# EAGLE design usbprog_small (EAGLE 4.16)
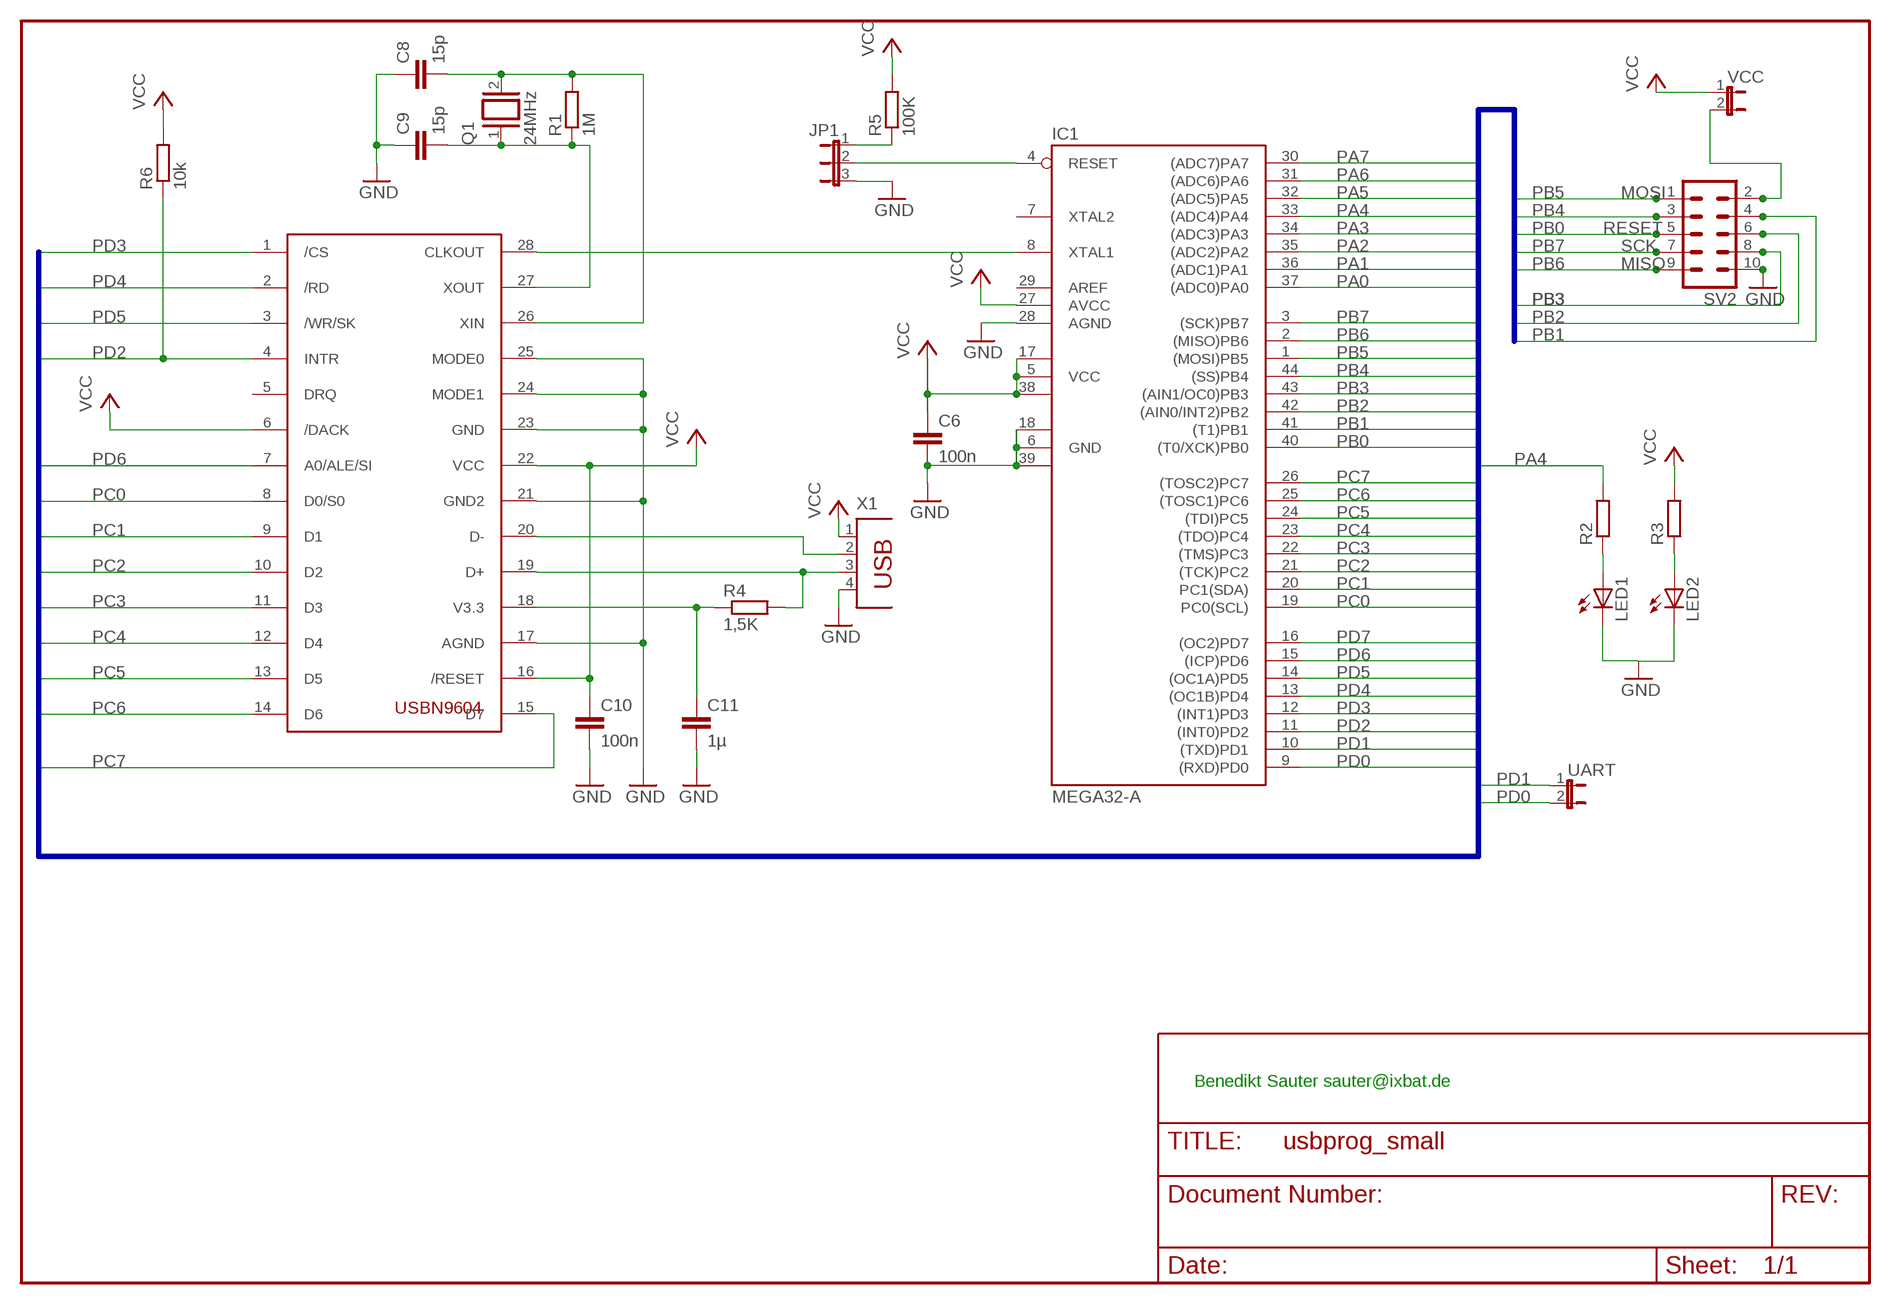
[diagram p0: schematic, sheet 1]

## Parts
C6  100n  C-EUC1206  [C1206]
C8  15p  C-EUC1206  [C1206]
C9  15p  C-EUC1206  [C1206]
C10  100n  C-EUC1206  [C1206]
C11  1µ  C-EUC1206  [C1206]
IC1  MEGA32-A  [TQFP44]
JP1  JP2E  [JP2]
LED1  LEDCHIP-LED0805  [CHIP-LED0805]
LED2  LEDCHIP-LED0805  [CHIP-LED0805]
M1  USBN9604  [SO28-3]
Q1  24MHz  XTAL/S  [QS]
R1  1M  R-EU_R1206  [R1206]
R2  R-EU_M1206  [M1206]
R3  R-EU_M1206  [M1206]
R4  1,5K  R-EU_M1206  [M1206]
R5  100K  R-EU_R1206  [R1206]
R6  10k  R-EU_R1206  [R1206]
SV2  ML10L  [ML10L]
UART  JP1E  [JP1]
VCC  JP1E  [JP1]
X1  PN61729  [PN61729]

## Nets
GND: C6.2 C8.1 C9.1 C10.2 C11.2 IC1.6(GND) IC1.18(GND1) IC1.28(AGND) IC1.39(GND2) JP1.3 LED1.C LED2.C M1.17(AGND) M1.21(GND2) M1.23(GND) M1.24(MODE1) M1.25(MODE0) SV2.10 X1.4
N$3: UART.1
N$4: IC1.8(XTAL1) M1.28(CLKOUT)
N$5: JP1.1 R5.1
N$7: C11.1 M1.18(V3.3) R4.1
N$8: C8.2 M1.26(XIN) Q1.2 R1.2
N$9: LED1.A R2.1
N$10: LED2.A R3.1
N$11: C9.2 M1.27(XOUT) Q1.1 R1.1
N$12: M1.19(D+) R4.2 X1.3
N$13: UART.2
N$14: SV2.2 VCC.2
N$15: M1.20(D-) X1.2
PA0: IC1.37((ADC0)PA0)
PA1: IC1.36((ADC1)PA1)
PA2: IC1.35((ADC2)PA2)
PA3: IC1.34((ADC3)PA3)
PA4: IC1.33((ADC4)PA4) R2.2
PA5: IC1.32((ADC5)PA5)
PA6: IC1.31((ADC6)PA6)
PA7: IC1.30((ADC7)PA7)
PB0: IC1.40((T0/XCK)PB0) SV2.5
PB1: IC1.41((T1)PB1) SV2.4
PB2: IC1.42((AIN0/INT2)PB2) SV2.6
PB3: IC1.43((AIN1/OC0)PB3) SV2.8
PB4: IC1.44((SS)PB4) SV2.3
PB5: IC1.1((MOSI)PB5) SV2.1
PB6: IC1.2((MISO)PB6) SV2.9
PB7: IC1.3((SCK)PB7) SV2.7
PC0: IC1.19(PC0(SCL)) M1.8(D0/S0)
PC1: IC1.20(PC1(SDA)) M1.9(D1)
PC2: IC1.21((TCK)PC2) M1.10(D2)
PC3: IC1.22((TMS)PC3) M1.11(D3)
PC4: IC1.23((TDO)PC4) M1.12(D4)
PC5: IC1.24((TDI)PC5) M1.13(D5)
PC6: IC1.25((TOSC1)PC6) M1.14(D6)
PC7: IC1.26((TOSC2)PC7) M1.15(D7)
PD0: IC1.9((RXD)PD0)
PD1: IC1.10((TXD)PD1)
PD2: IC1.11((INT0)PD2) M1.4(INTR) R6.1
PD3: IC1.12((INT1)PD3) M1.1(/CS)
PD4: IC1.13((OC1B)PD4) M1.2(/RD)
PD5: IC1.14((OC1A)PD5) M1.3(/WR/SK)
PD6: IC1.15((ICP)PD6) M1.7(A0/ALE/SI)
PD7: IC1.16((OC2)PD7)
RESET: IC1.4(RESET) JP1.2
VCC: C6.1 C10.1 IC1.5(VCC) IC1.17(VCC1) IC1.27(AVCC) IC1.38(VCC2) M1.6(/DACK) M1.16(/RESET) M1.22(VCC) R3.2 R5.2 R6.2 VCC.1 X1.1
Unconnected: IC1.7(XTAL2) M1.5(DRQ)

## Buses
PD0,PD1,PD2,PD3,PD4,PD5,PD6,PD7,PC0,PC1,PC2,PC3,PC4,PC5,PC6,PC7,PB0,PB1,PB2,PB3,PB4,PB5,PB6,PB7,PA0,PA1,PA2,PA3,PA4,PA5,PA6,PA7

## Notes on the sheet
- MOSI
- PB4
- RESET
- SCK
- MISO
- PB3 | PB3
- PB2
- PB1
- Benedikt Sauter sauter@ixbat.de

## Power pins joined to a net without a drawn wire
AREF: IC1.29(AREF)

## Library data of the parts
C6 C8-C11 = rcl:C-EU: CAPACITOR, European symbol
IC1 = avr:MEGA32: MICROCONTROLLER 32 Kbytes FLASH 2 Kbytes SRAM 1 Kbytes EEPROM USART 8-channel 10 bit ADC
JP1 = jumper:JP2E: JUMPER
LED1 LED2 = led:LED: LED OSRAM: - CHIPLED LG R971, LG N971, LY N971, LG Q971, LY Q971, LO R971, LY R971 LH N974, LH R974 LS Q976, LO Q976, LY Q976 LO Q996 - Hyper CHIPLED LW Q18S LB Q993, LB Q99A, LB R99A - SideLED LS A670, LO A670, LY A670, LG A670, LP A670 LB A673, LV A673, LT A673, LW A673 LH A674 LY A675 LS A676, LA A676, LO A676, LY A676, LW A676 LS A679, LY A679, LG A679 - Hyper Micro SIDELED® LS Y876, LA Y876, LO Y876, LY Y876 LT Y87S - SmartLED LW L88C, LW L88S LB L89C, LB L89S, LG L890 LS L89K, LO L89K, LY L89K LS L896, LA L896, LO L896, LY L896 - TOPLED LS T670, LO T670, LY T670, LG T670, LP T670 LSG T670, LSP T670, LSY T670, LOP T670, LYG T670 LG T671, LOG T671, LSG T671 LB T673, LV T673, LT T673, LW T673 LH T674 LS T676, LA T676, LO T676, LY T676, LB T676, LH T676, LSB T676, LW T676 LB T67C, LV T67C, LT T67C, LS T67K, LO T67K, LY T67K, LW E67C LS E67B, LA E67B, LO E67B, LY E67B, LB E67C, LV E67C, LT E67C LW T67C LS T679, LY T679, LG T679 LS T770, LO T770, LY T770, LG T770, LP T770 LB T773, LV T773, LT T773, LW T773 LH T774 LS E675, LA E675, LY E675, LS T675 LS T776, LA T776, LO T776, LY T776, LB T776 LHGB T686 LT T68C, LB T68C - Hyper Mini TOPLED® LB M676 - Mini TOPLED Santana® LG M470 LS M47K, LO M47K, LY M47K Source: http://www.osram.convergy.de/
M1 = bene:USBN9604
Q1 = special:XTAL/S: CRYSTAL
R1-R6 = rcl:R-EU_: RESISTOR, European symbol
SV2 = con-harting-ml:ML10: HARTING
UART VCC = jumper:JP1E: JUMPER
X1 = con-berg:PN61729: BERG USB connector

## Board
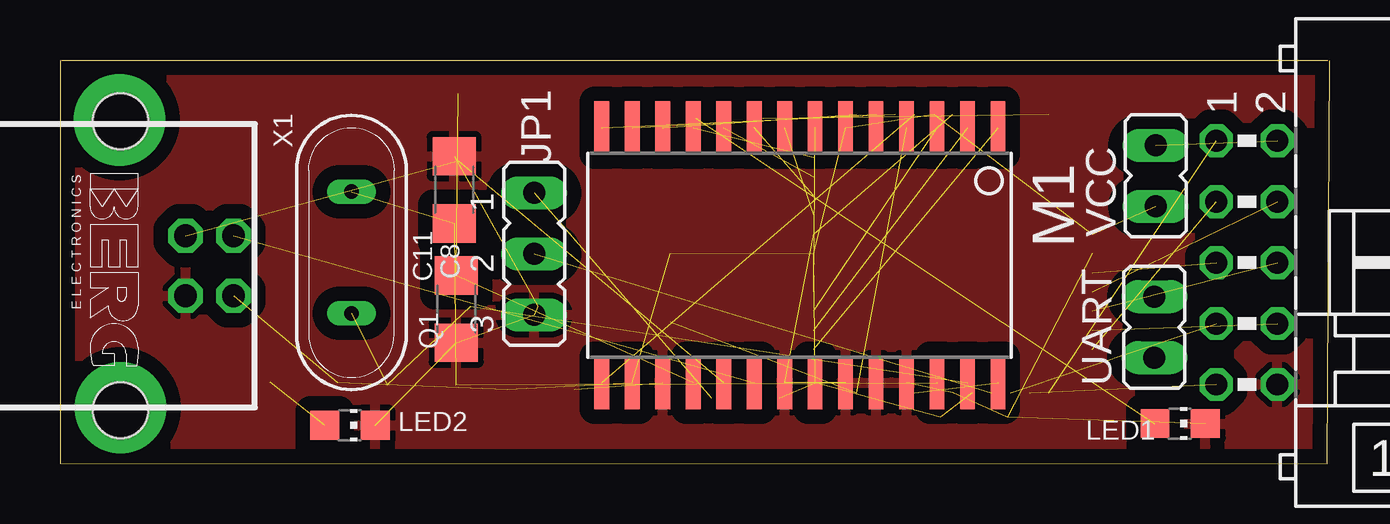
[diagram p1: board, top side]
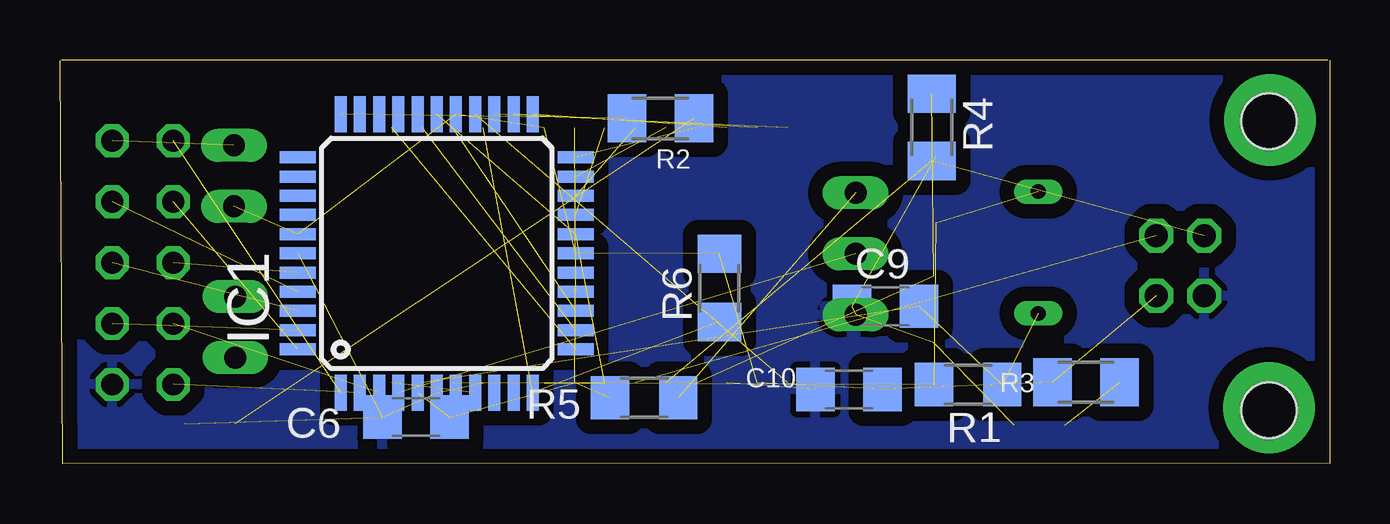
[diagram p2: board, bottom side, seen from below]

Size 52.9 x 16.81 mm. Coordinates in mm from the lower left corner, seen from the top.
Outline: 52.9,16.78 52.8,0 0,0.01 0,16.81
Outline: 0.07,16.81 52.82,16.81
Copper layers (1*16): Top 0.035mm / dielectric 1.5mm / Bottom 0.035mm
Design rules "ZWILLING": minimum track width 5mil, minimum drill 20mil, track to track 4mil, track to pad 4mil, pad to pad 4mil, via to via 4mil, smd to smd 0mil, copper to edge 1mil, drill to drill 1mil, minimum pad ring 8mil, minimum via ring 8mil, stop-mask expansion 4mil, vias tented up to drill 0mil, thermal gap 10mil

### Footprints (pad centres in the part's own frame; a part is rotated, then mirrored left to right if it is on the bottom)
C1206 = smd 1.6 x 1.8: 1 -1.4,0; 2 1.4,0
TQFP44 = smd 1.5 x 0.5: 1 -5.8,4; 2 -5.8,3.2; 3 -5.8,2.4; 4 -5.8,1.6; 5 -5.8,0.8; 6 -5.8,0; 7 -5.8,-0.8; 8 -5.8,-1.6; 9 -5.8,-2.4; 10 -5.8,-3.2; 11 -5.8,-4; 23 5.8,-4; 24 5.8,-3.2; 25 5.8,-2.4; 26 5.8,-1.6; 27 5.8,-0.8; 28 5.8,0; 29 5.8,0.8; 30 5.8,1.6; 31 5.8,2.4; 32 5.8,3.2; 33 5.8,4 | smd 0.5 x 1.5: 12 -4,-5.8; 13 -3.2,-5.8; 14 -2.4,-5.8; 15 -1.6,-5.8; 16 -0.8,-5.8; 17 0,-5.8; 18 0.8,-5.8; 19 1.6,-5.8; 20 2.4,-5.8; 21 3.2,-5.8; 22 4,-5.8; 34 4,5.8; 35 3.2,5.8; 36 2.4,5.8; 37 1.6,5.8; 38 0.8,5.8; 39 0,5.8; 40 -0.8,5.8; 41 -1.6,5.8; 42 -2.4,5.8; 43 -3.2,5.8; 44 -4,5.8
JP2 = drill 0.914 long: 1 -2.54,0; 2 0,0; 3 2.54,0
CHIP-LED0805 = smd 1.2 x 1.2: A 0,-1.05; C 0,1.05
SO28-3 = smd 0.61 x 2.21: 1 -8.255,-5.315; 2 -6.985,-5.315; 3 -5.715,-5.315; 4 -4.445,-5.315; 5 -3.175,-5.315; 6 -1.905,-5.315; 7 -0.635,-5.315; 8 0.635,-5.315; 9 1.905,-5.315; 10 3.175,-5.315; 11 4.445,-5.315; 12 5.715,-5.315; 13 6.985,-5.315; 14 8.255,-5.315; 15 8.255,5.315; 16 6.985,5.315; 17 5.715,5.315; 18 4.445,5.315; 19 3.175,5.315; 20 1.905,5.315; 21 0.635,5.315; 22 -0.635,5.315; 23 -1.905,5.315; 24 -3.175,5.315; 25 -4.445,5.315; 26 -5.715,5.315; 27 -6.985,5.315; 28 -8.255,5.315
QS = drill 0.61 long: 1 -2.54,0; 2 2.54,0
R1206 = smd 1.6 x 1.803: 1 -1.422,0; 2 1.422,0
M1206 = smd 1.6 x 2: 1 -1.4,0; 2 1.4,0
ML10L = drill 0.914 octagon: 1 -5.08,-1.27; 2 -5.08,1.27; 3 -2.54,-1.27; 4 -2.54,1.27; 5 0,-1.27; 6 0,1.27; 7 2.54,-1.27; 8 2.54,1.27; 9 5.08,-1.27; 10 5.08,1.27
JP1 = drill 0.914 long: 1 0,-1.27; 2 0,1.27
PN61729 = drill 0.95 octagon: 1 1.25,4.71; 2 -1.25,4.71; 3 -1.25,2.71; 4 1.25,2.71 | hole 2.3: -6.02,0; 6.02,0

### Placement (x,y rotation side)
C6  38.07,1.94 180 bottom
C8  16.42,11.41 270 top
C9  18.5,6.56 0 bottom
C10  20.03,3.09 180 bottom
C11  16.51,6.43 270 top
IC1  37.21,8.76 90 bottom
JP1  19.75,8.73 270 top
LED1  46.67,1.67 270 top
LED2  12.08,1.6 270 top
M1  30.83,8.68 180 top
Q1  12.14,8.79 90 top
R1  15.07,3.29 180 bottom
R2  27.89,14.38 180 bottom
R3  10.15,3.38 180 bottom
R4  16.58,14.01 270 bottom
R5  28.57,2.74 180 bottom
R6  25.43,7.32 90 bottom
SV2  49.45,8.37 270 top
UART  45.6,5.69 0 top
VCC  45.65,11.98 0 top
X1  2.52,8.24 270 top

### Tracks (layer width: path | path; a pad name or v marks a point on that pad's centre or on a via)
GND  (12 unrouted)
  pour Bottom (isolate 0.61): -0.37,16.51 52.45,16.64 52.85,-0.09 -0.12,-0.07
  pour Top (isolate 0.61): -0.07,16.68 52.85,16.65 53.13,-0.05 -0.11,0.16
N$1  (via drill 1.6 pad 3.81)
  other vias: 2.48,14.32
N$2  (via drill 1.6 pad 3.81)
  other vias: 2.52,2.33
N$4  (1 unrouted)
N$5  (1 unrouted)
N$7  (2 unrouted)
N$8  (3 unrouted)
N$9  (1 unrouted)
N$10  (1 unrouted)
N$11  (3 unrouted)
N$12  (2 unrouted)
N$14  (1 unrouted)
N$15  (1 unrouted)
PA4  (1 unrouted)
PB0  (1 unrouted)
PB1  (1 unrouted)
PB2  (1 unrouted)
PB3  (1 unrouted)
PB4  (1 unrouted)
PB5  (1 unrouted)
PB6  (1 unrouted)
PB7  (1 unrouted)
PC0  (1 unrouted)
PC1  (1 unrouted)
PC2  (1 unrouted)
PC3  (1 unrouted)
PC4  (1 unrouted)
PC5  (1 unrouted)
PC6  (1 unrouted)
PC7  (1 unrouted)
PD2  (2 unrouted)
PD3  (1 unrouted)
PD4  (1 unrouted)
PD5  (1 unrouted)
PD6  (1 unrouted)
RESET  (1 unrouted)
VCC  (13 unrouted)